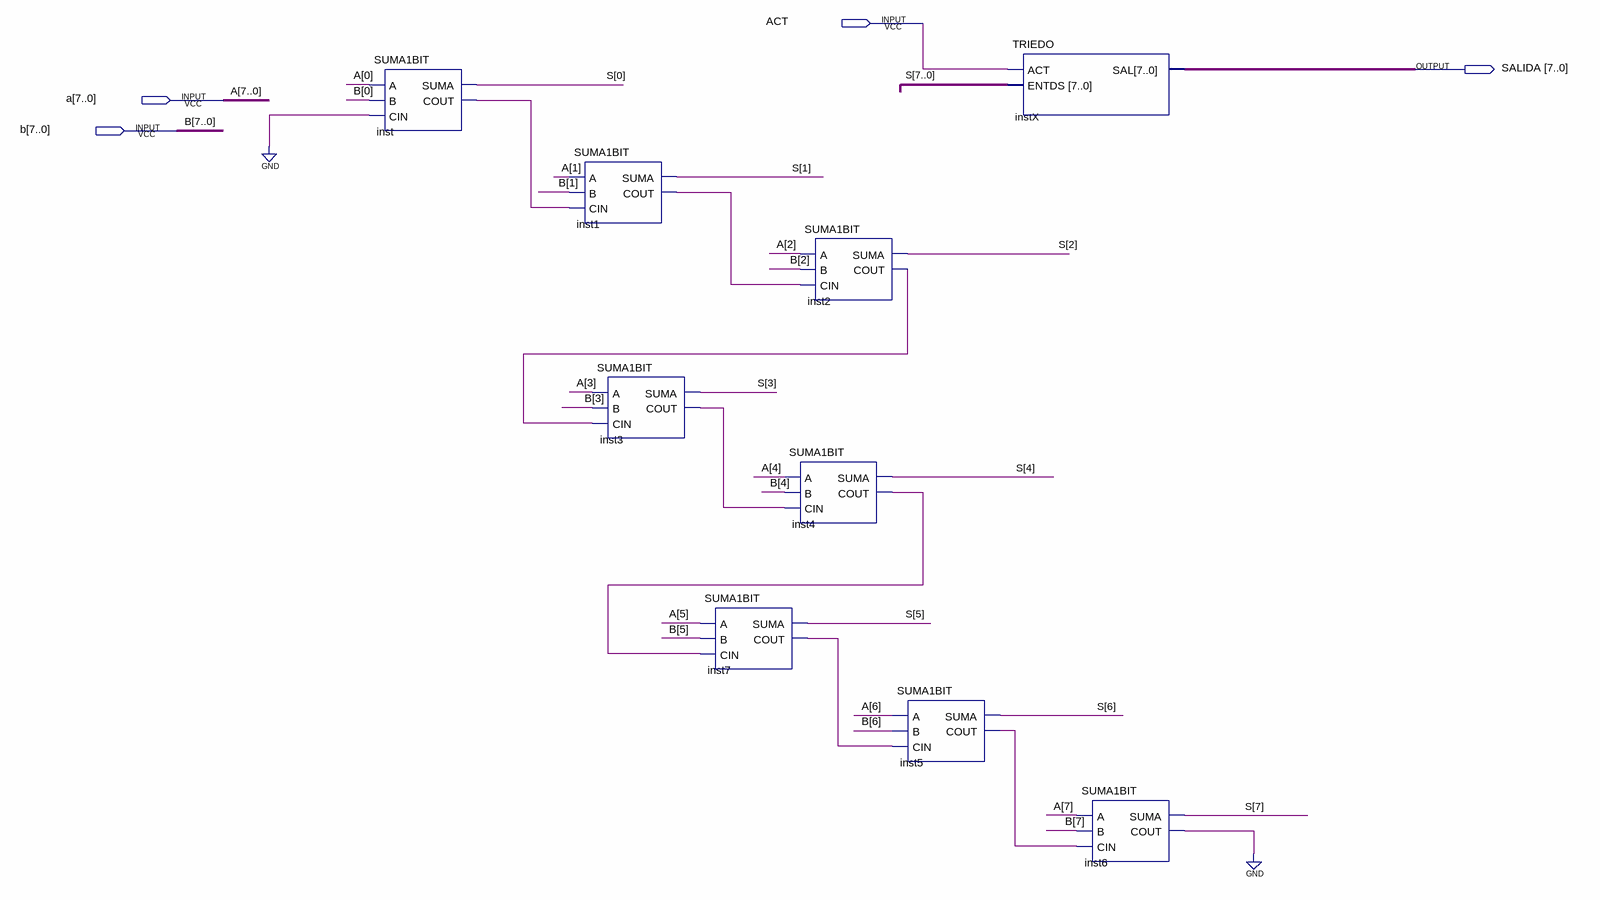
[diagram p0: schematic sheet]
// Quartus schematic SUMA.bdf as structural Verilog: 9 symbols, 4 pins
module SUMA (
  input  ACT,
  input  [7:0] a,
  input  [7:0] b,
  output [7:0] SALIDA
);

  wire inst1_cout, inst2_cout, inst3_cout, inst4_cout, inst5_cout, inst6_cout, inst7_cout, inst_cout;
  wire [7:0] S;

  SUMA1BIT inst (.A(a[0]), .B(b[0]), .CIN(1'b0), .SUMA(S[0]), .COUT(inst_cout));
  SUMA1BIT inst1 (.A(a[1]), .B(b[1]), .CIN(inst_cout), .SUMA(S[1]), .COUT(inst1_cout));
  SUMA1BIT inst3 (.A(a[3]), .B(b[3]), .CIN(inst2_cout), .SUMA(S[3]), .COUT(inst3_cout));
  SUMA1BIT inst7 (.A(a[5]), .B(b[5]), .CIN(inst4_cout), .SUMA(S[5]), .COUT(inst7_cout));
  SUMA1BIT inst2 (.A(a[2]), .B(b[2]), .CIN(inst1_cout), .SUMA(S[2]), .COUT(inst2_cout));
  SUMA1BIT inst4 (.A(a[4]), .B(b[4]), .CIN(inst3_cout), .SUMA(S[4]), .COUT(inst4_cout));
  SUMA1BIT inst5 (.A(a[6]), .B(b[6]), .CIN(inst7_cout), .SUMA(S[6]), .COUT(inst5_cout));
  TRIEDO instX (.ACT(ACT), .ENTDS(S), .SAL(SALIDA));
  SUMA1BIT inst6 (.A(a[7]), .B(b[7]), .CIN(inst5_cout), .SUMA(S[7]), .COUT(inst6_cout));
  // also tied to GND on the sheet: inst6_cout
endmodule
